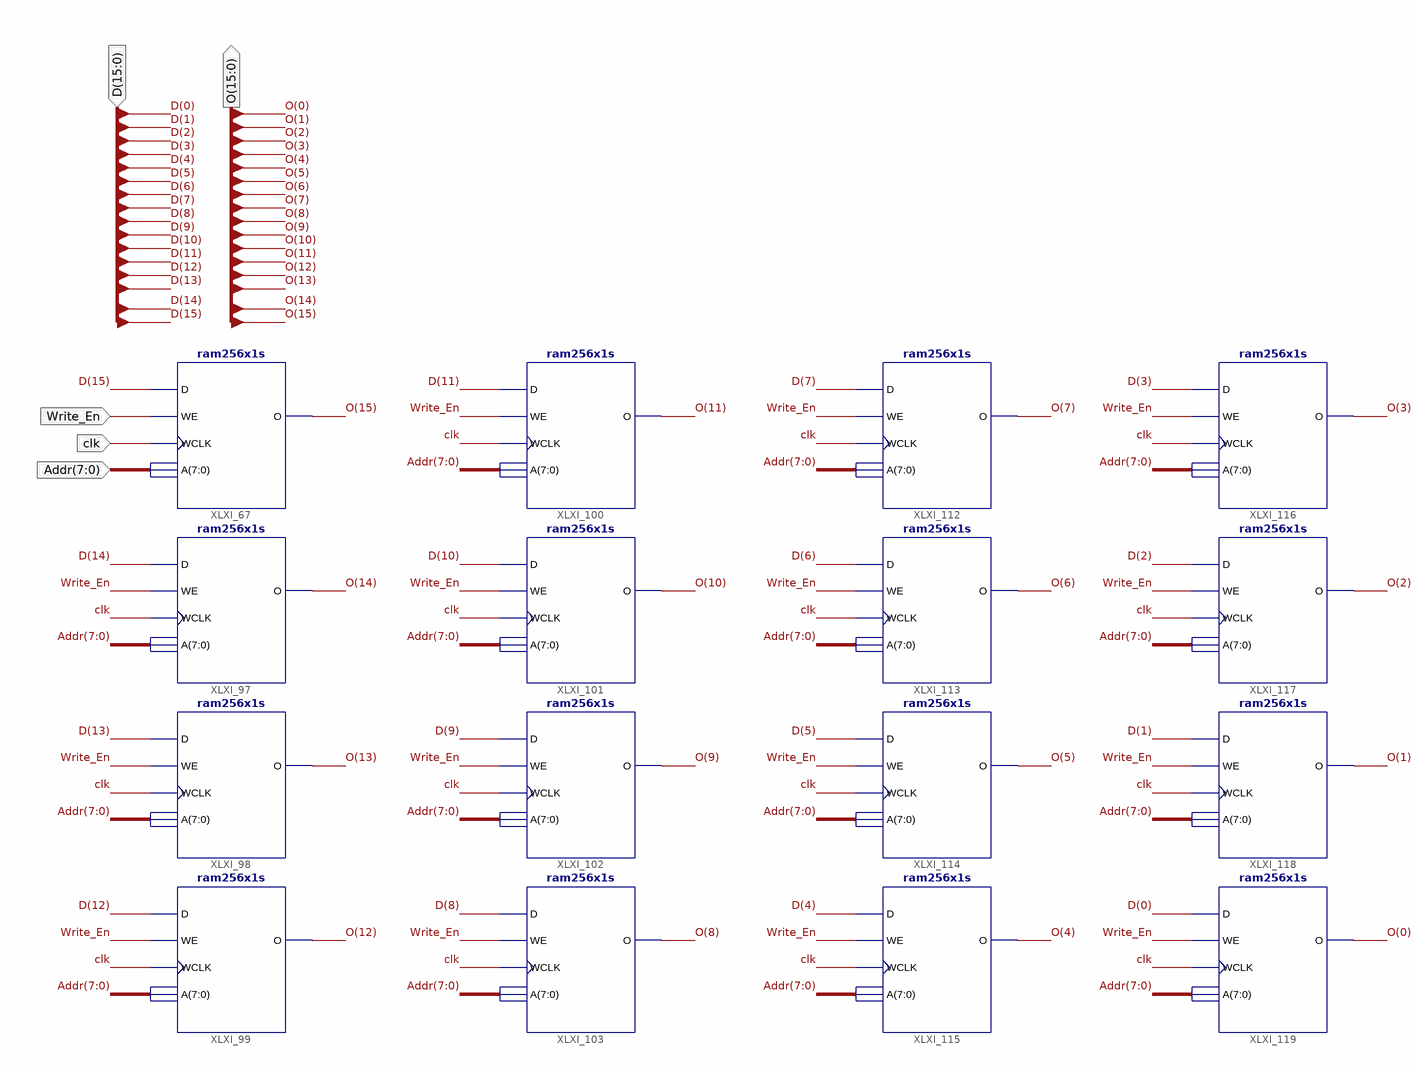
[diagram p0: schematic sheet 1]
// Xilinx ISE schematic RAM_256x16.sch (virtex6) as structural Verilog: 16 symbols, 5 ports
module RAM_256x16 (
  input  [7:0] Addr,
  input  Write_En,
  input  clk,
  input  [15:0] D,
  output [15:0] O
);

  ram256x1s XLXI_116 (.WE(Write_En), .WCLK(clk), .D(D[3]), .O(O[3]), .A(Addr));
  ram256x1s XLXI_117 (.WE(Write_En), .WCLK(clk), .D(D[2]), .O(O[2]), .A(Addr));
  ram256x1s XLXI_118 (.WE(Write_En), .WCLK(clk), .D(D[1]), .O(O[1]), .A(Addr));
  ram256x1s XLXI_119 (.WE(Write_En), .WCLK(clk), .D(D[0]), .O(O[0]), .A(Addr));
  ram256x1s XLXI_67 (.WE(Write_En), .WCLK(clk), .D(D[15]), .O(O[15]), .A(Addr));
  ram256x1s XLXI_97 (.WE(Write_En), .WCLK(clk), .D(D[14]), .O(O[14]), .A(Addr));
  ram256x1s XLXI_98 (.WE(Write_En), .WCLK(clk), .D(D[13]), .O(O[13]), .A(Addr));
  ram256x1s XLXI_99 (.WE(Write_En), .WCLK(clk), .D(D[12]), .O(O[12]), .A(Addr));
  ram256x1s XLXI_100 (.WE(Write_En), .WCLK(clk), .D(D[11]), .O(O[11]), .A(Addr));
  ram256x1s XLXI_101 (.WE(Write_En), .WCLK(clk), .D(D[10]), .O(O[10]), .A(Addr));
  ram256x1s XLXI_102 (.WE(Write_En), .WCLK(clk), .D(D[9]), .O(O[9]), .A(Addr));
  ram256x1s XLXI_103 (.WE(Write_En), .WCLK(clk), .D(D[8]), .O(O[8]), .A(Addr));
  ram256x1s XLXI_112 (.WE(Write_En), .WCLK(clk), .D(D[7]), .O(O[7]), .A(Addr));
  ram256x1s XLXI_113 (.WE(Write_En), .WCLK(clk), .D(D[6]), .O(O[6]), .A(Addr));
  ram256x1s XLXI_114 (.WE(Write_En), .WCLK(clk), .D(D[5]), .O(O[5]), .A(Addr));
  ram256x1s XLXI_115 (.WE(Write_En), .WCLK(clk), .D(D[4]), .O(O[4]), .A(Addr));
endmodule
